# Altium schematic sheet main.SchDoc
size A3
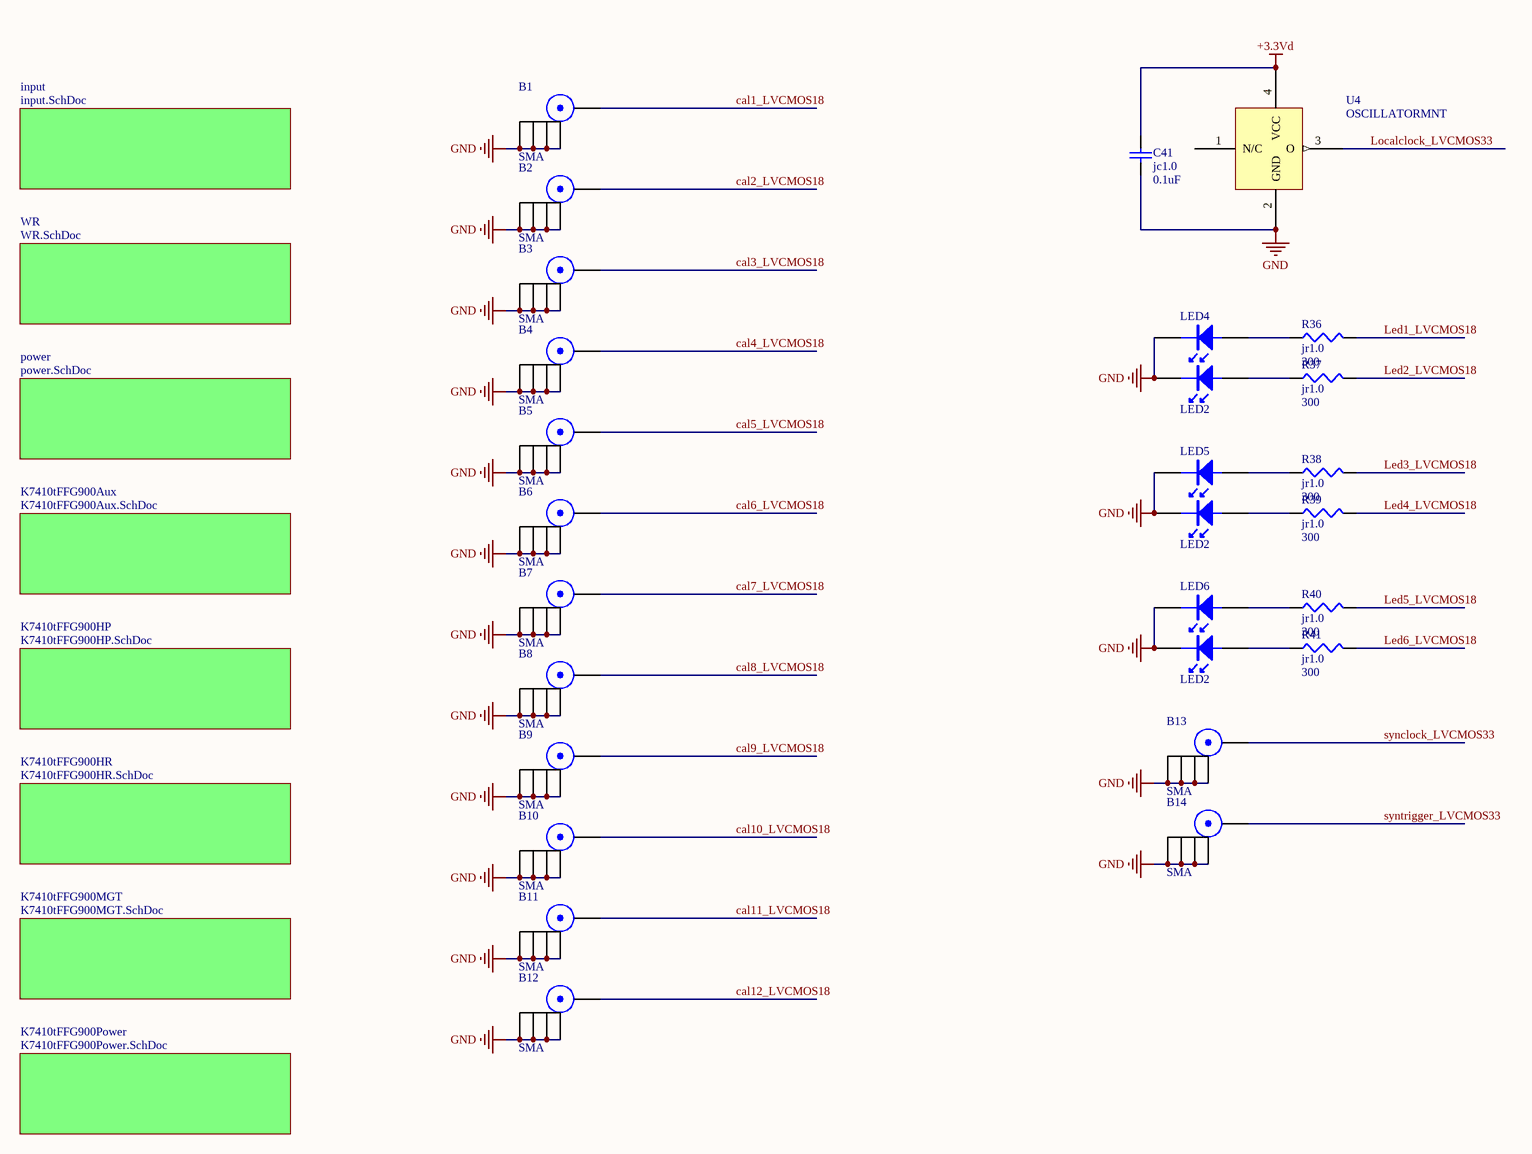
[diagram p0: main.SchDoc]

## Parts
B1  SMA  [SMA_2]
B2  SMA  [SMA_2]
B3  SMA  [SMA_2]
B4  SMA  [SMA_2]
B5  SMA  [SMA_2]
B6  SMA  [SMA_2]
B7  SMA  [SMA_2]
B8  SMA  [SMA_2]
B9  SMA  [SMA_2]
B10  SMA  [SMA_2]
B11  SMA  [SMA_2]
B12  SMA  [SMA_2]
B13  SMA  [SMA_2]
B14  SMA  [SMA_2]
C41  jc1.0  value 0.1uF  [0603]
LED4  LED2  [LED2]
LED5  LED2  [LED2]
LED6  LED2  [LED2]
R36  jr1.0  value 300  [0805]
R37  jr1.0  value 300  [0805]
R38  jr1.0  value 300  [0805]
R39  jr1.0  value 300  [0805]
R40  jr1.0  value 300  [0805]
R41  jr1.0  value 300  [0805]
U4  OSCILLATORMNT  [S11]

## Sub-sheets
input = input.SchDoc: no entries
K7410tFFG900Aux = K7410tFFG900Aux.SchDoc: no entries
K7410tFFG900HP = K7410tFFG900HP.SchDoc: no entries
K7410tFFG900HR = K7410tFFG900HR.SchDoc: no entries
K7410tFFG900MGT = K7410tFFG900MGT.SchDoc: no entries
K7410tFFG900Power = K7410tFFG900Power.SchDoc: no entries
power = power.SchDoc: no entries
WR = WR.SchDoc: no entries

## Nets
+3.3Vd: C41.2 U4.4(VCC)
GND: B1.2(GND) B1.3(GND) B1.4(GND) B1.5(GND) B2.2(GND) B2.3(GND) B2.4(GND) B2.5(GND) B3.2(GND) B3.3(GND) B3.4(GND) B3.5(GND) B4.2(GND) B4.3(GND) B4.4(GND) B4.5(GND) B5.2(GND) B5.3(GND) B5.4(GND) B5.5(GND) B6.2(GND) B6.3(GND) B6.4(GND) B6.5(GND) B7.2(GND) B7.3(GND) B7.4(GND) B7.5(GND) B8.2(GND) B8.3(GND) B8.4(GND) B8.5(GND) B9.2(GND) B9.3(GND) B9.4(GND) B9.5(GND) B10.2(GND) B10.3(GND) B10.4(GND) B10.5(GND) B11.2(GND) B11.3(GND) B11.4(GND) B11.5(GND) B12.2(GND) B12.3(GND) B12.4(GND) B12.5(GND) B13.2(GND) B13.3(GND) B13.4(GND) B13.5(GND) B14.2(GND) B14.3(GND) B14.4(GND) B14.5(GND) C41.1 LED4.2 LED4.4 LED5.2 LED5.4 LED6.2 LED6.4 U4.2(GND)
cal1_LVCMOS18: B1.1(X)
cal2_LVCMOS18: B2.1(X)
cal3_LVCMOS18: B3.1(X)
cal4_LVCMOS18: B4.1(X)
cal5_LVCMOS18: B5.1(X)
cal6_LVCMOS18: B6.1(X)
cal7_LVCMOS18: B7.1(X)
cal8_LVCMOS18: B8.1(X)
cal9_LVCMOS18: B9.1(X)
cal10_LVCMOS18: B10.1(X)
cal11_LVCMOS18: B11.1(X)
cal12_LVCMOS18: B12.1(X)
Led1_LVCMOS18: R36.2
Led2_LVCMOS18: R37.2
Led3_LVCMOS18: R38.2
Led4_LVCMOS18: R39.2
Led5_LVCMOS18: R40.2
Led6_LVCMOS18: R41.2
Localclock_LVCMOS33: U4.3(O)
synclock_LVCMOS33: B13.1(X)
syntrigger_LVCMOS33: B14.1(X)
NetLED4_1: LED4.1 R37.1
NetLED4_3: LED4.3 R36.1
NetLED5_1: LED5.1 R39.1
NetLED5_3: LED5.3 R38.1
NetLED6_1: LED6.1 R41.1
NetLED6_3: LED6.3 R40.1

Not connected (* = marked no-connect by the designer): U4 1(N/C)

## Library data of the parts
C41 = Cap: Capacitor; Published: 8-Jun-2000; LatestRevisionDate: 17-Jul-2002; LatestRevisionNote: Re-released for DXP Platform.; PackageReference: RAD-0.3; Publisher: Altium Limited
R36-R41 = Res: Resistor; Published: 8-Jun-2000; LatestRevisionDate: 04-Mar-2005; LatestRevisionNote: PCB Footprint replaced.; PackageReference: J1-0603; Publisher: Altium Limited
U4 = OSCILLATOR